# Altium schematic sheet soldier_TIA.SchDoc
size Tabloid; SheetNumber: 3; SheetTotal: 6
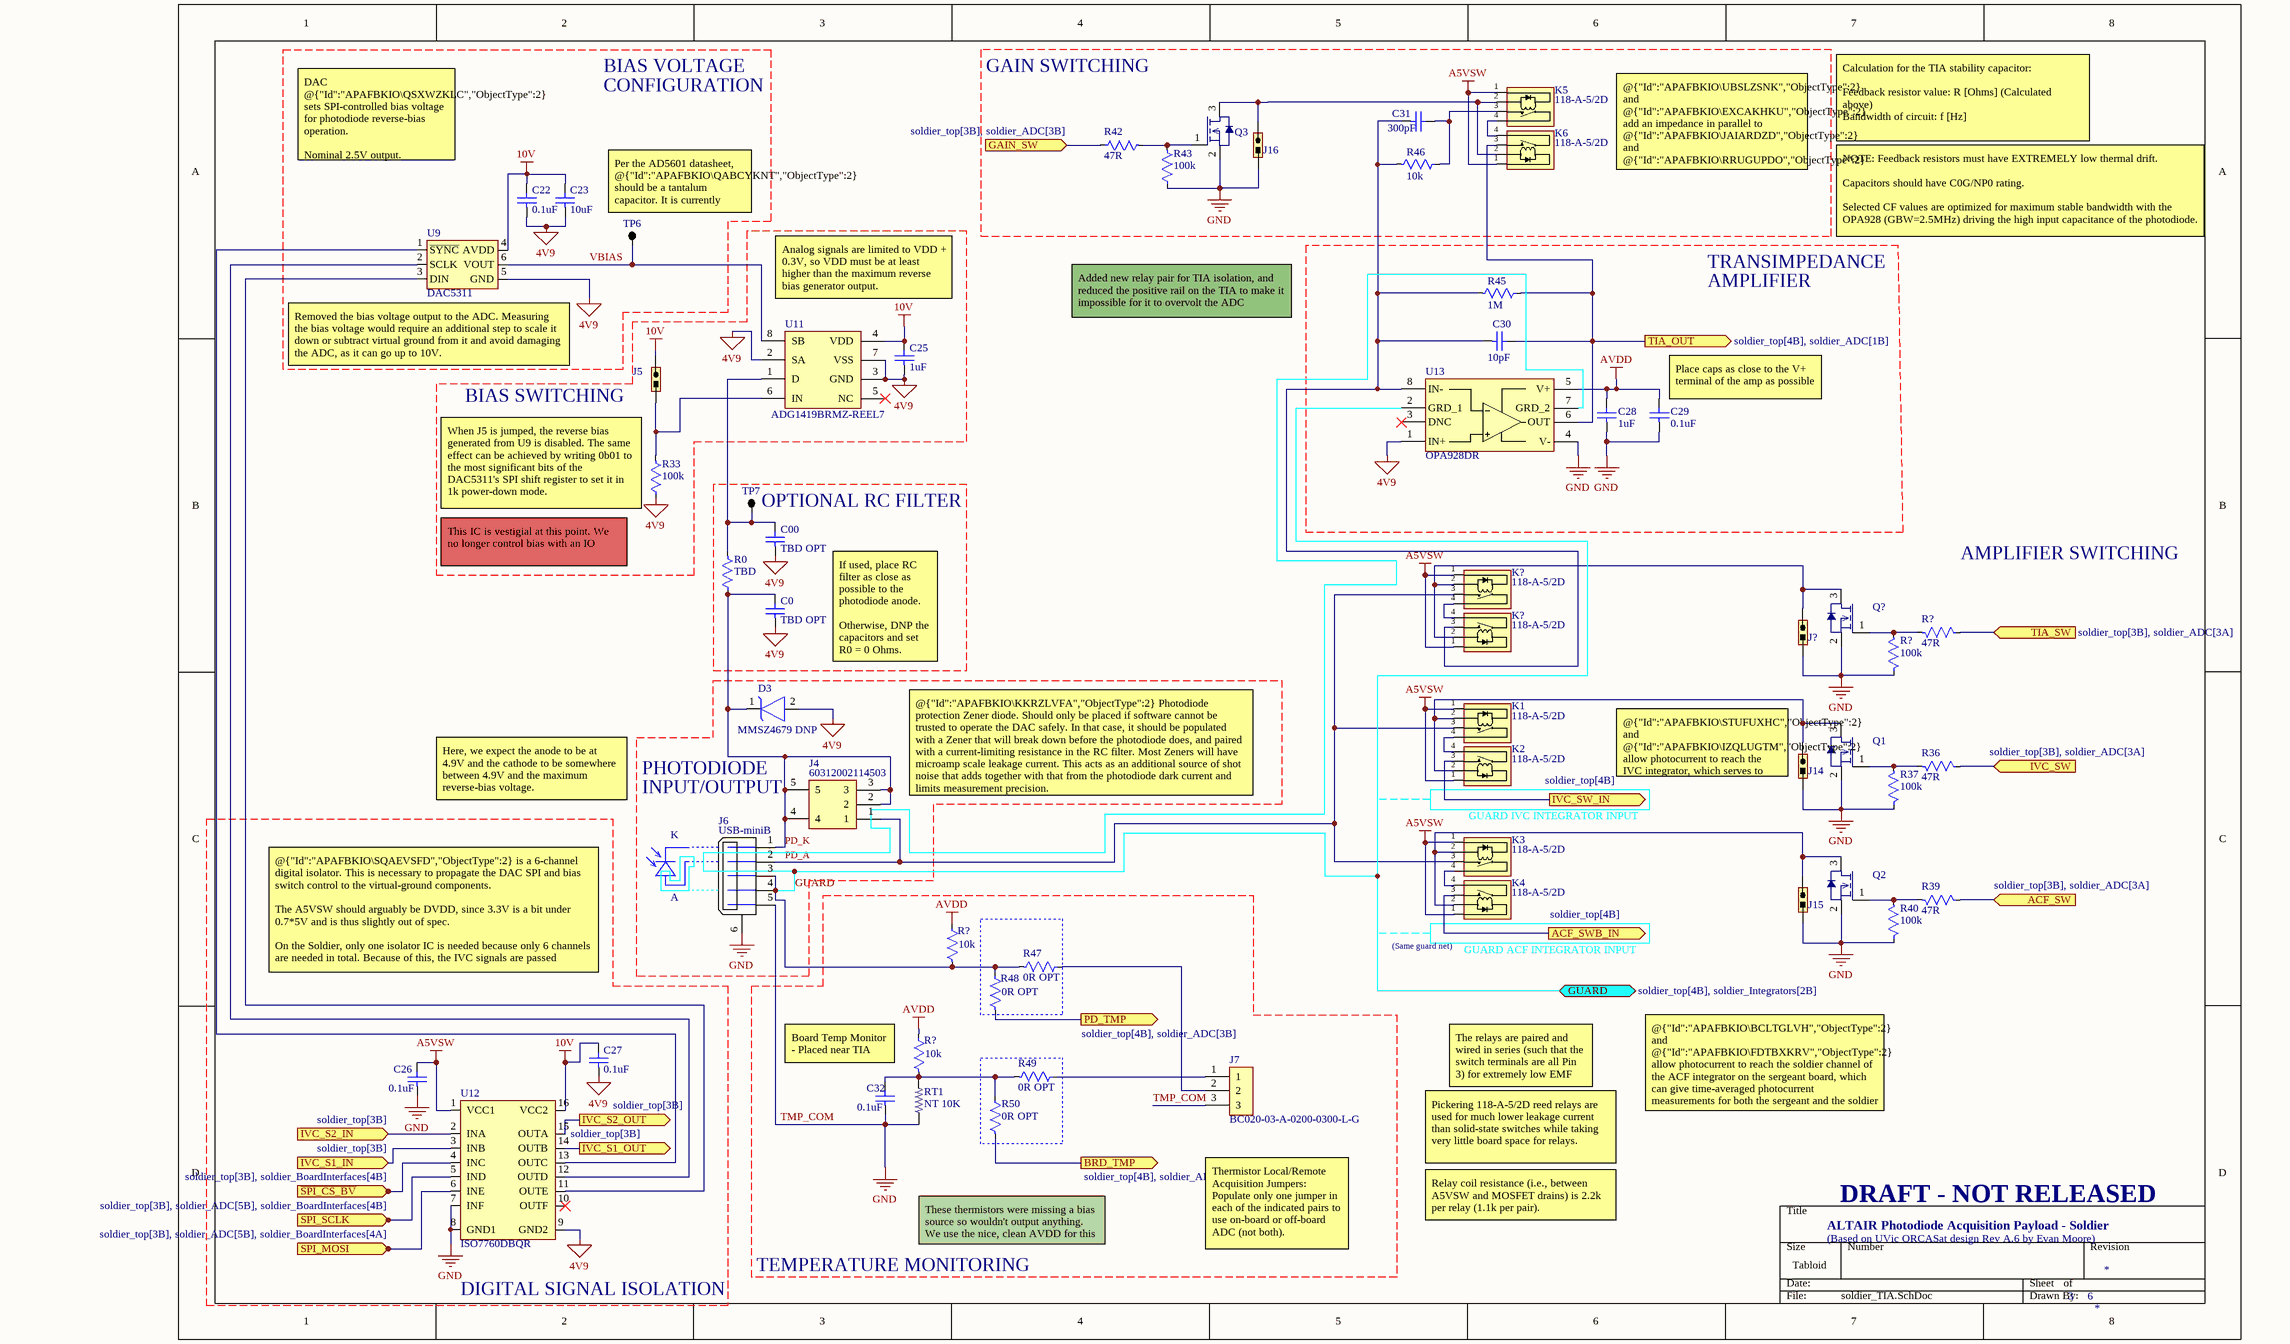
[diagram p0: soldier_TIA.SchDoc]

## Parts
(Parts that share a designator on the sheet are numbered #1, #2 ... from top to bottom, then left to right.)
C00  TBD OPT  [CAP 0603 IPC MID DENSITY]
C0  TBD OPT  [CAP 0603 IPC MID DENSITY]
C22  0.1uF  [CAP 0603 IPC MID DENSITY]
C23  10uF  [CAP 1206 IPC LOW DENSITY]
C25  1uF  [CAP 0603 IPC MID DENSITY]
C26  0.1uF  [CAP 0603 IPC MID DENSITY]
C27  0.1uF  [CAP 0603 IPC MID DENSITY]
C28  1uF  [CAP 0603 IPC MID DENSITY]
C29  0.1uF  [CAP 0603 IPC MID DENSITY]
C30  10pF  [CAP 1206 UNKNOWN]
C31  300pF  [CAP 1206 NON-IPC KEMET NP0]
C32  0.1uF  [CAP 0603 IPC MID DENSITY]
D3  MMSZ4679 DNP  [SOD-123 ONSEMI SMALL PADS]
J4  60312002114503  [COAX SMA THT]
J5  Jumper  [JUMPER 2POS 2.54MM PITCH THT]  (value not drawn)
J6  USB-miniB  [USB-miniB]
J7  BC020-03-A-0200-0300-L-G  [JUMPER 3POS 1MM PITCH THT]
J14  Jumper  [JUMPER 2POS 2.54MM PITCH THT]  (value not drawn)
J15  Jumper  [JUMPER 2POS 2.54MM PITCH THT]  (value not drawn)
J16  Jumper  [JUMPER 2POS 2.54MM PITCH THT]  (value not drawn)
J?  Jumper  [JUMPER 2POS 2.54MM PITCH THT]  (value not drawn)
K1  118-A-5/2D  [118-A-5/2D]
K2  118-A-5/2D  [118-A-5/2D]
K3  118-A-5/2D  [118-A-5/2D]
K4  118-A-5/2D  [118-A-5/2D]
K5  118-A-5/2D  [118-A-5/2D]
K6  118-A-5/2D  [118-A-5/2D]
K?#1  118-A-5/2D  [118-A-5/2D]
K?#2  118-A-5/2D  [118-A-5/2D]
Q1  DMG2302UK  [SOT90-3 LOW DENSITY]  (value not drawn)
Q2  DMG2302UK  [SOT90-3 LOW DENSITY]  (value not drawn)
Q3  DMG2302UK  [SOT90-3 LOW DENSITY]  (value not drawn)
Q?  DMG2302UK  [SOT90-3 LOW DENSITY]  (value not drawn)
R0  TBD  [RES 0402 IPC MID DENSITY]
R33  100k  [RES 0603 IPC MID DENSITY]
R36  47R  [RES 0603 IPC MID DENSITY]
R37  100k  [RES 0603 IPC MID DENSITY]
R39  47R  [RES 0603 IPC MID DENSITY]
R40  100k  [RES 0603 IPC MID DENSITY]
R42  47R  [RES 0603 IPC MID DENSITY]
R43  100k  [RES 0603 IPC MID DENSITY]
R45  1M  [RES 1206 IPC MID DENSITY]
R46  10k  [RES 1206 IPC MID DENSITY]
R47  0R OPT  [RES 0603 IPC MID DENSITY]
R48  0R OPT  [RES 0603 IPC MID DENSITY]
R49  0R OPT  [RES 0603 IPC MID DENSITY]
R50  0R OPT  [RES 0603 IPC MID DENSITY]
R?#1  47R  [RES 0603 IPC MID DENSITY]
R?#2  100k  [RES 0603 IPC MID DENSITY]
R?#3  10k  [RES 0603 IPC MID DENSITY]
R?#4  10k  [RES 0603 IPC MID DENSITY]
RT1  value NT 10K  [RES 0603 IPC MID DENSITY]  (hidden comment: NTC 0603 10K 1%)
TP6  Testpoint  [TESTPOINT THT]  (value not drawn)  (no BOM)
TP7  Testpoint  [TESTPOINT THT]  (value not drawn)  (no BOM)
U9  DAC5311  [SOT363-6 MID DENSITY]
U11  ADG1419BRMZ-REEL7  [8-TSOP 0.65MM PITCH 3MM WIDTH IPC LOW DENSITY]
U12  ISO7760DBQR  [16-SSOP 0.635MM PITCH 5.4MM WIDTH NON-IPC TI]
U13  OPA928DR  [8-SOIC 4MM WIDE MID DENSITY]

## Blocks framed on the sheet
GAIN SWITCHING: C31 J16 K5 K6 Q3 R42 R43 R46
BIAS SWITCHING: C25 J5 R33 U11
OPTIONAL RC FILTER: C0 C00 R0 TP7
DIGITAL SIGNAL ISOLATION: C26 C27 U12
TEMPERATURE MONITORING: C32 J7 R47-R50 R?#3 R?#4 RT1

## Ports
ACF_SW (in, see soldier_top[3B], soldier_ADC[3A]), ACF_SWB_IN (out, see soldier_top[4B]), BRD_TMP (out, see soldier_top[4B], soldier_ADC[3B]), GAIN_SW (in, see soldier_top[3B], soldier_ADC[3B]), GUARD (bidir, see soldier_top[4B], soldier_Integrators[2B]), IVC_S1_IN (in, see soldier_top[3B]), IVC_S1_OUT (out, see soldier_top[3B]), IVC_S2_IN (in, see soldier_top[3B]), IVC_S2_OUT (out, see soldier_top[3B]), IVC_SW (in, see soldier_top[3B], soldier_ADC[3A]), IVC_SW_IN (out, see soldier_top[4B]), PD_TMP (out, see soldier_top[4B], soldier_ADC[3B]), SPI_MOSI (in, see soldier_top[3B], soldier_ADC[5B], soldier_BoardInterfaces[4A]), SPI_SCLK (in, see soldier_top[3B], soldier_ADC[5B], soldier_BoardInterfaces[4B]), TIA_OUT (out, see soldier_top[4B], soldier_ADC[1B]), TIA_SW (in, see soldier_top[3B], soldier_ADC[3A]), ~{SPI_CS_BV} (in, see soldier_top[3B], soldier_BoardInterfaces[4B])

## Nets
4V9: C00.1 C0.1 C22.1 C23.1 C25.1 C27.1 D3.2(Anode) R33.2 U9.5(GND) U11.2(SA) U11.3(GND) U11.7(VSS) U12.9(GND2) U13.1(IN+)
10V: C22.2 C23.2 C25.2 C27.2 J5.2 U9.4(AVDD) U11.4(VDD) U12.16(VCC2)
A5VSW: C26.2 K1.1 K2.1 K3.1 K4.1 K5.1 K6.1 K?#1.1 K?#2.1 U12.1(VCC1)
AVDD: C28.2 C29.2 R?#3.2 R?#4.2 U13.5(V+)
TMP_COM: C26.1 C28.1 C29.1 C32.1 J6.5 J6.6(SHLD) J7.3 J14.1 J15.1 J16.1 J?.1 Q1.2(Source) Q2.2(Source) Q3.2(Source) Q?.2(Source) R37.2 R40.2 R43.2 R?#2.2 RT1.1 U12.7(INF) U12.8(GND1) U13.4(V-)  [also labelled GND]
~{SPI_CS_BV}: U12.4(INC) ; port ~{SPI_CS_BV}
ACF_SW: R39.2 ; port ACF_SW
ACF_SWB_IN: K4.3 ; port ACF_SWB_IN
BRD_TMP: R50.1 ; port BRD_TMP
GAIN_SW: R42.2 ; port GAIN_SW
GUARD: J6.3 J6.4 R47.1 R48.2 R?#3.1 U13.2(GRD_1) U13.7(GRD_2) ; port GUARD
IVC_S1_IN: U12.3(INB) ; port IVC_S1_IN
IVC_S1_OUT: U12.14(OUTB) ; port IVC_S1_OUT
IVC_S2_IN: U12.2(INA) ; port IVC_S2_IN
IVC_S2_OUT: U12.15(OUTA) ; port IVC_S2_OUT
IVC_SW: R36.2 ; port IVC_SW
IVC_SW_IN: K2.3 ; port IVC_SW_IN
PD_A: J4.1 J6.2 K1.3 K3.3 K?#1.3
PD_K: C0.2 D3.1(Cathode) J4.2 J4.3 J4.4 J4.5 J6.1 R0.2
PD_TMP: R48.1 ; port PD_TMP
SPI_MOSI: U12.6(INE) ; port SPI_MOSI
SPI_SCLK: U12.5(IND) ; port SPI_SCLK
TIA_OUT: C30.2 K6.3 R45.2 U13.6(OUT) ; port TIA_OUT
TIA_SW: R?#1.2 ; port TIA_SW
VBIAS: TP6.1 U9.6(VOUT) U11.8(SB)
NetC00_2: C00.2 R0.1 TP7.1 U11.1(D)
NetC30_1: C30.1 C31.1 K?#2.3 R45.1 R46.1 U13.8(IN-)
NetC31_2: C31.2 K5.3 R46.2
NetC32_2: C32.2 R49.1 R50.2 R?#4.1 RT1.2
NetJ5_1: J5.1 R33.1 U11.6(IN)
NetJ7_1: J7.1 R49.2
NetJ7_2: J7.2 R47.2
NetJ14_2: J14.2 K1.2 K2.2 Q1.3(Drain)
NetJ15_2: J15.2 K3.2 K4.2 Q2.3(Drain)
NetJ16_2: J16.2 K5.2 K6.2 Q3.3(Drain)
NetJ?_2: J?.2 K?#1.2 K?#2.2 Q?.3(Drain)
NetK1_4: K1.4 K2.4
NetK3_4: K3.4 K4.4
NetK5_4: K5.4 K6.4
NetK?#1_4: K?#1.4 K?#2.4
NetQ1_1: Q1.1(Gate) R36.1 R37.1
NetQ2_1: Q2.1(Gate) R39.1 R40.1
NetQ3_1: Q3.1(Gate) R42.1 R43.1
NetQ?_1: Q?.1(Gate) R?#1.1 R?#2.1
NetU9_1: U9.1(~{SYNC}) U12.13(OUTC)
NetU9_2: U9.2(SCLK) U12.12(OUTD)
NetU9_3: U9.3(DIN) U12.11(OUTE)

Not connected (* = marked no-connect by the designer): U11 5(NC)*; U12 10(OUTF)*; U13 3(DNC)*

## Notes on the sheet
- BIAS VOLTAGE
- CONFIGURATION
- Calculation for the TIA stability capacitor:
  Feedback resistor value: R [Ohms] (Calculated above)
  Bandwidth of circuit: f [Hz]
  C = 1/(2pi R f) [F]
- DAC @{"Id":"APAFBKIO\QSXWZKLC","ObjectType":2} sets SPI-controlled bias voltage for photodiode reverse-bias operation.
  Nominal 2.5V output.
- Per the AD5601 datasheet, @{"Id":"APAFBKIO\QABCYKNT","ObjectType":2} should be a tantalum capacitor. It is currently specified as an MLCC.
- @{"Id":"APAFBKIO\UBSLZSNK","ObjectType":2} and @{"Id":"APAFBKIO\EXCAKHKU","ObjectType":2} add an impedance in parallel to @{"Id":"APAFBKIO\JAIARDZD","ObjectType":2} and @{"Id":"APAFBKIO\RRUGUPDO","ObjectType":2} to lower the gain of the TIA, which measures the photocurrent in the case where the laser is not being pulsed.
- TRANSIMPEDANCE
- NOTE: Feedback resistors must have EXTREMELY low thermal drift.
  Capacitors should have C0G/NP0 rating.
  Selected CF values are optimized for maximum stable bandwidth with the OPA928 (GBW=2.5MHz) driving the high input capacitance of the photodiode.
- Analog signals are limited to VDD + 0.3V, so VDD must be at least higher than the maximum reverse bias generator output.
- Added new relay pair for TIA isolation, and reduced the positive rail on the TIA to make it impossible for it to overvolt the ADC
- AMPLIFIER
- (near U9) Removed the bias voltage output to the ADC. Measuring the bias voltage would require an additional step to scale it down or subtract virtual ground from it and avoid damaging the ADC, as it can go up to 10V.
- (near C29) Place caps as close to the V+ terminal of the amp as possible
- (near R33) When J5 is jumped, the reverse bias generated from U9 is disabled. The same effect can be achieved by writing 0b01 to the most significant bits of the DAC5311's SPI shift register to set it in 1k power-down mode.
- (near R33) This IC is vestigial at this point. We no longer control bias with an IO
- AMPLIFIER SWITCHING
- If used, place RC filter as close as possible to the photodiode anode.
  Otherwise, DNP the capacitors and set R0 = 0 Ohms.
- Here, we expect the anode to be at 4.9V and the cathode to be somewhere between 4.9V and the maximum reverse-bias voltage.
- PHOTODIODE
- INPUT/OUTPUT
- @{"Id":"APAFBKIO\KKRZLVFA","ObjectType":2} Photodiode protection Zener diode. Should only be placed if software cannot be trusted to operate the DAC safely. In that case, it should be populated with a Zener that will break down before the photodiode does, and paired with a current-limiting resistance in the RC filter. Most Zeners will have microamp scale leakage current. This acts as an additional source of shot noise that adds together with that from the photodiode dark current and limits measurement precision.
- GUARD IVC INTEGRATOR INPUT
- (near J14) @{"Id":"APAFBKIO\STUFUXHC","ObjectType":2} and @{"Id":"APAFBKIO\IZQLUGTM","ObjectType":2} allow photocurrent to reach the IVC integrator, which serves to validate the value read from the soldier channel of the ACF.
- K
- A
- @{"Id":"APAFBKIO\SQAEVSFD","ObjectType":2} is a 6-channel digital isolator. This is necessary to propagate the DAC SPI and bias switch control to the virtual-ground components.
  The A5VSW should arguably be DVDD, since 3.3V is a bit under 0.7*5V and is thus slightly out of spec.
  On the Soldier, only one isolator IC is needed because only 6 channels are needed in total. Because of this, the IVC signals are passed through the 2 remaining channels on this isolator.
- (near K4) (Same guard net)
- (near K4) GUARD ACF INTEGRATOR INPUT
- Board Temp Monitor
  - Placed near TIA
- The relays are paired and wired in series (such that the switch terminals are all Pin 3) for extremely low EMF
- @{"Id":"APAFBKIO\BCLTGLVH","ObjectType":2} and @{"Id":"APAFBKIO\FDTBXKRV","ObjectType":2} allow photocurrent to reach the soldier channel of the ACF integrator on the sergeant board, which can give time-averaged photocurrent measurements for both the sergeant and the soldier photodiodes with nearly identical characteristics between the two.
- Pickering 118-A-5/2D reed relays are used for much lower leakage current than solid-state switches while taking very little board space for relays.
- These thermistors were missing a bias source so wouldn't output anything. We use the nice, clean AVDD for this now.
- Relay coil resistance (i.e., between A5VSW and MOSFET drains) is 2.2k per relay (1.1k per pair).
- ALTAIR Photodiode Acquisition Payload - Soldier
- (Based on UVic ORCASat design Rev A.6 by Evan Moore)
- DRAFT - NOT RELEASED
- Thermistor Local/Remote Acquisition Jumpers:
  Populate only one jumper in each of the indicated pairs to use on-board or off-board ADC (not both).

## Library data of the parts
C00 C0 = CAP: Murata GRT188R61H105KE13D - Cap Ceramic 1uF 10% 50V X5R 0603 (Placeholder); MF: Murata; MP: GRT188R61H105KE13D
C22 C26 C27 C29 C32 = CAP: Kemet C0603C104K5RACAUTO - Cap Ceramic 0.1uF 50V X7R 10% 0603 125C Paper T/R; MF: Kemet; MP: C0603C104K5RACAUTO
  C26 C27: Parameter 1: *; Parameter 2: *
C23 = CAP: Murata GRT319R6YA106KE01D - Cap Ceramic 10uF 35V X5R 10% Pad SMD 1206 85C Automotive T/R; MF: Murata; MP: GRT319R6YA106KE01D
C25 C28 = CAP: Murata GRT188R61H105KE13D - Cap MLCC AEEC-Q200 X5R 1uF 50V 0603; MF: Murata; MP: GRT188R61H105KE13D
C30 = CAP: Wurth Elektronik 885012008037 - Cap Ceramic 10pF 5% 50V NP0 1206; MF: Wurth Elektronik; MP: 885012008037
C31 = CAP: Kemet C1206C301K5GACTU - Cap Ceramic 300pF 10% 50V NP0 1206; MF: Kemet; MP: C1206C301K5GACTU
D3 = Zener: DIODE ZENER SOD123; MF: onsemi; MP: MMSZ4679T1G
J4 = 60312002114503: Coaxial, SMA Female Jack, 50 Ohm, Through-Hole; MF: Wurth Elektronik; Datasheet Link: https://katalog.we-online.de/em/datasheet/60312002114503.pdf; Height: 9.56mm; MP: 60312002114503; Mouser Part Number: 710-60312002114503; Mouser Price/Stock: https://www.mouser.co.uk/ProductDetail/Wurth-Elektronik/60312002114503?qs=3jNSNtuqJTL%2FGpZA1FAOxw%3D%3D
J5 J14-J16 J? = Jumper 2POS: CONN HEADER VERT 2POS; MF: Samtec Inc.; MP: TSW-101-23-G-D; Supplier 1: Digi-Key; Supplier Part Number 1: SAM1068-01-ND; Operating Temperature: -55°C ~ 125°C
J6 = USB-miniB: Conn Mini-USB RCP 5 POS Solder ST Thru-Hole 5 Terminal 1 Port; Number of Positions: 5; Gender: Female; MF: Amphenol Commercial; MP: UE25BE5510H; RoHS: Yes; Category: USB Connectors; Stock 1: 6446; Mount: Through Hole; Color: Black; Contact Material: Copper Alloy; Contact Plating: Gold; Number of Contacts: 5; Termination: PCB; Features: High Temperature; Lead Free: Lead Free; Flammability Rating: UL94 V-0; ComponentLink1URL: http://components.arrow.com/part/dataview/0323_00956300?src-supplier=Arrow+Europe; ComponentLink1Description: http://components.arrow.com/part/dataview/0323_00956300?src-supplier=Arrow+Europe; ComponentLink2URL: http://www.alliedelec.com/m/d/e7e3d7a920045eebbdef787e60d8b001.pdf?src-supplier=Allied+Electronics; ComponentLink2Description: http://www.alliedelec.com/m/d/e7e3d7a920045eebbdef787e60d8b001.pdf?src-supplier=Allied+Electronics; ComponentLink3URL: https://www.amphenolcanada.com/ProductSearch/drawings/AC/UE25BEX510X.pdf?src-supplier=Digi-Key; ComponentLink3Description: https://www.amphenolcanada.com/ProductSearch/drawings/AC/UE25BEX510X.pdf?src-supplier=Digi-Key; Supplier 1: Digi-Key; Supplier Part Number 1: UE25BE5510H-ND
J7 = BC020-03-A-0200-0300-L-G: 3x1 Header SMD; MF: GCT (GLOBAL CONNECTOR TECHNOLOGY); Datasheet Link: https://www.mouser.com/datasheet/2/837/BC020-1948594.pdf; Height: 3.2mm; MP: BC020-03-A-0200-0300-L-G
K1-K6 K?#1 K?#2 = RELAY 118-A-5/2D: High coil resistance SIL/SIP Reed Relay 118-A-5/2D; MF: Pickering; MP: 118-1-A-5/2D
Q1-Q3 Q? = NMOS DMG2302UK: DIODES INC. Power MOSFET, N Channel, 20 V, 2.8 A, 0.061 ohm, SOT-23, Surface Mount; MP: DMG2302UK-7; ComponentLink1URL: http://www.farnell.com/datasheets/2814387.pdf?src-supplier=Farnell; ComponentLink1Description: http://www.farnell.com/datasheets/2814387.pdf?src-supplier=Farnell; ComponentLink2URL: http://www.farnell.com/datasheets/2814387.pdf?src-supplier=Element14; ComponentLink2Description: http://www.farnell.com/datasheets/2814387.pdf?src-supplier=Element14; ComponentLink3URL: https://www.diodes.com/assets/Datasheets/DMG2302UK.pdf?src-supplier=Digi-Key; ComponentLink3Description: https://www.diodes.com/assets/Datasheets/DMG2302UK.pdf?src-supplier=Digi-Key; ComponentLink4URL: http://www.farnell.com/datasheets/2814387.pdf?src-supplier=Newark; ComponentLink4Description: http://www.farnell.com/datasheets/2814387.pdf?src-supplier=Newark; Supplier 1: Digi-Key; Supplier Part Number 1: DMG2302UK-7DICT-ND; MF: Diodes
R0 = RES: Yageo RC0402JR-070RL - Res 0 Ohms 1/16W SMD 0402; MF: YAGEO; MP: RC0402JR-070RL
R33 R37 R40 R43 R?#2 = RES: Panasonic ERJ-3GEYJ104V - Res 100k 5% 1/10W SMD 0603; MF: Panasonic Electronic Components; MP: ERJ-3GEYJ104V
R36 R39 R42 R?#1 = RES: Vishay CRCW060347R0JNEA - Res 47Ohm 5% 1/8W SMD 0603; MF: Vishay Dale; MP: CRCW060347R0JNEA
R45 = RES: Vishay TNPV12061M00BYEN - Res 1MOhm 0.1% 1/4W SMD 1206; MF: Vishay Dale; MP: TNPV12061M00BYEN
R46 = RES: Stackpole RNCF1206TKY10K0 - Res 10k 0.01% 1/4W SMD 1206; MF: Stackpole Electronics Inc.; MP: RNCF1206TKY10K0
R47-R50 = RES: Vishay CRCW06030000Z0EA - Res 0 Ohms 1/8W SMD 0603; MF: Vishay Dale; MP: CRCW06030000Z0EA
R?#3 R?#4 = RES
RT1 = THERM_RES NTC 0603 10K 1%: THERMISTOR NTC 10KOHM 3380K 0603; MF: Murata; MP: NCU18XH103F60RB; RoHS: No; Category: Thermistors; Stock 1: 48580; Case/Package: 0603; Case Code (Metric): 1608; Case Code (Imperial): 0603; Min Operating Temperature: -40°C; Max Operating Temperature: 125°C; REACH SVHC: No SVHC; ComponentLink1URL: http://www.farnell.com/datasheets/2095755.pdf?src-supplier=Farnell; ComponentLink1Description: http://www.farnell.com/datasheets/2095755.pdf?src-supplier=Farnell; ComponentLink2URL: https://www.murata.com/en-us/products/productdata/8796836233246/L0770E.pdf?src-supplier=Digi-Key; ComponentLink2Description: https://www.murata.com/en-us/products/productdata/8796836233246/L0770E.pdf?src-supplier=Digi-Key; ComponentLink3URL: http://www.farnell.com/datasheets/2095755.pdf?src-supplier=Element14; ComponentLink3Description: http://www.farnell.com/datasheets/2095755.pdf?src-supplier=Element14; Supplier 1: Digi-Key; Supplier Part Number 1: 490-16279-1-ND
U9 = DAC5311: DAC 8bit 1 channel SPI Supply Reference Buffered Voltage; MF: Texas Instruments; MP: DAC5311IDCKR
U11 = ADG1419BRMZ-REEL7: Analog Switch Single SPDT 8-Pin MSOP T/R; MF: Analog Devices; Number of Inputs: 1; Number of Outputs: 2; Min Supply Voltage: 5V; Operating Supply Voltage: 12V; Max Supply Voltage: 16.5V; Min Dual Supply Voltage: 4.5V; Max Power Dissipation: 2mW; On-State Resistance: 2.4R; Turn-On Delay Time: 110ns; Turn-Off Delay Time: 140ns; Max Supply Current: 95uA; -3db Bandwidth: 135MHz; Supply Type: Single,Dual; Dual Supply Voltage: 15V; Polarity: Non-Inverting; Interface: Parallel; Test Frequency: 1MHz; Insertion Loss: 0.16dB; Supplier 1: Digi-Key; MP: ADG1419BRMZ-REEL7; RoHS: Yes; Category: Decoders and Multiplexers; Stock 1: 12144; Pricing 1: 1=4.40000, 10=3.95100, 25=3.73520, 100=3.07100, 250=2.75560, 500=2.65600 (USD); Case/Package: MSOP; Number of Pins: 8; Contact Plating: Tin,Matte; Min Operating Temperature: -40°C; Max Operating Temperature: 125°C; Number of Channels: 1; Max Dual Supply Voltage: 16.5V; Package Quantity: 1000; Packaging: Tape and Reel; Number of Circuits: 1; Throw Configuration: SPDT; Power Dissipation: 2mW; Bandwidth: 135MHz; Radiation Hardening: No; Lead Free: Contains Lead; ComponentLink1URL: https://datasheet.ciiva.com/15127/getdatasheetpartid-348881-15127783.pdf?src-supplier=Verical; ComponentLink1Description: https://datasheet.ciiva.com/15127/getdatasheetpartid-348881-15127783.pdf?src-supplier=Verical; ComponentLink2URL: https://datasheet.ciiva.com/14846/adg1419-14846917.pdf?src-supplier=Digi-Key; ComponentLink2Description: https://datasheet.ciiva.com/14846/adg1419-14846917.pdf?src-supplier=Digi-Key; ComponentLink3URL: https://datasheet.ciiva.com/14846/adg1419-14846919.pdf?src-supplier=Digi-Key; ComponentLink3Description: https://datasheet.ciiva.com/14846/adg1419-14846919.pdf?src-supplier=Digi-Key; ComponentLink4URL: https://datasheet.ciiva.com/16637/adg1419-16637818.pdf?src-supplier=Avnet+Europe; ComponentLink4Description: https://datasheet.ciiva.com/16637/adg1419-16637818.pdf?src-supplier=Avnet+Europe; ComponentLink5URL: https://datasheet.ciiva.com/2980/adg1419-2980845.pdf?src-supplier=Avnet; ComponentLink5Description: https://datasheet.ciiva.com/2980/adg1419-2980845.pdf?src-supplier=Avnet; ComponentLink6URL: https://datasheet.ciiva.com/48708/001247710-da-01-en-ic-switch-2-adg1419brmz-reel7-msop-8-adi-48708556.pdf?src-supplier=Conrad; ComponentLink6Description: https://datasheet.ciiva.com/48708/001247710-da-01-en-ic-switch-2-adg1419brmz-reel7-msop-8-adi-48708556.pdf?src-supplier=Conrad; Supplier Part Number 1: ADG1419BRMZ-REEL7CT-ND
U12 = ISO7760DBQR: Digital Isolator 6-Channel 6/0 Inputs 16SSOP; MF: Texas Instruments; MP: ISO7760DBQR
U13 = OPA928DR: Op Amp, 36V, fA input, precision, e-trim; MF: Texas Instruments; Datasheet Link: https://www.ti.com/lit/ds/symlink/opa928.pdf?HQS=dis-mous-null-mousermode-dsf-pf-null-wwe&ts=1731036524091&ref_url=https%253A%252F%252Fwww.ti.com%252Fgeneral%252Fdocs%252Fsuppproductinfo.tsp%253FdistId%253D26%2526gotoUrl%253Dhttps%253A%252F%252Fwww.ti.com; Height: 1.75mm; MP: OPA928DR; Mouser Part Number: 595-OPA928DR; Mouser Price/Stock: https://www.mouser.co.uk/ProductDetail/Texas-Instruments/OPA928DR?qs=2wMNvWM5ZX5RgAZJHoeYSw%3D%3D; Arrow Part Number: OPA928DR; Arrow Price/Stock: null?region=nac